# EAGLE schematic weather_sensor_attiny85 (EAGLE 8.4.2)
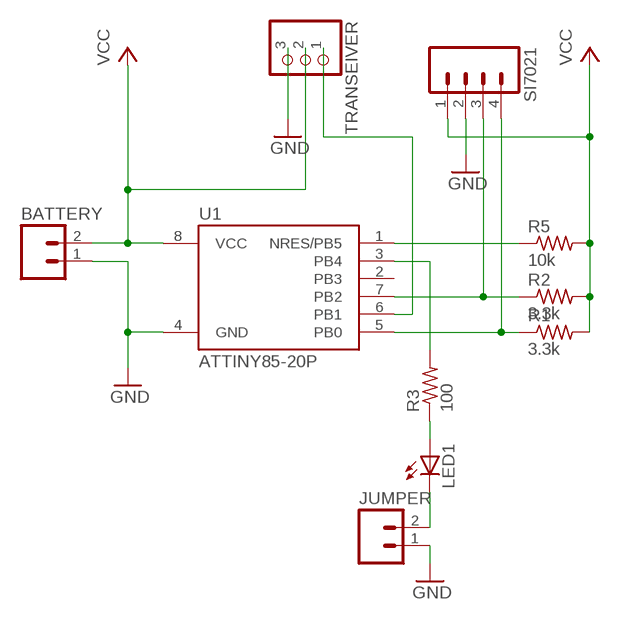
[diagram p0: schematic, sheet 1]

## Parts
BATTERY  M02LOCK  [1X02_LOCK]
JUMPER  M02LOCK  [1X02_LOCK]
LED1  LEDCHIPLED_0603  [CHIPLED_0603]
R1  3.3k  R-US_R0402  [R0402]
R2  3.3k  R-US_R0402  [R0402]
R3  100  R-US_R0402  [R0402]
R5  10k  R-US_R0402  [R0402]
SI7021  M04LONGPADS  [1X04_LONGPADS]
TRANSEIVER  PINHD-1X3  [1X03]
U1  ATTINY85-20P  [PDIP08_300MIL]

## Nets
GND: BATTERY.1 JUMPER.1 SI7021.2 TRANSEIVER.3 U1.4(GND)
N$1: JUMPER.2 LED1.C
N$2: TRANSEIVER.1 U1.6(PB1)
N$4: R1.1 SI7021.4 U1.5(PB0)
N$5: R2.1 SI7021.3 U1.7(PB2)
N$7: R3.2 U1.3(PB4)
N$8: R5.1 U1.1(NRES/PB5)
N$9: LED1.A R3.1
VCC: BATTERY.2 R1.2 R2.2 R5.2 SI7021.1 TRANSEIVER.2 U1.8(VCC)
Unconnected: U1.2(PB3)

## Library data of the parts
BATTERY JUMPER = SparkFun:M02: Header 2 Standard 2-pin 0.1" header. Use with straight break away headers (SKU : PRT-00116), right angle break away headers (PRT-00553), swiss pins (PRT-00743), machine pins (PRT-00117), and female headers (PRT-00115). Molex polarized connector foot print use with SKU : PRT-08233 with associated crimp pins and housings.
LED1 = adafruit:LED: LED OSRAM: - CHIPLED LG R971, LG N971, LY N971, LG Q971, LY Q971, LO R971, LY R971 LH N974, LH R974 LS Q976, LO Q976, LY Q976 LO Q996 - Hyper CHIPLED LW Q18S LB Q993, LB Q99A, LB R99A - SideLED LS A670, LO A670, LY A670, LG A670, LP A670 LB A673, LV A673, LT A673, LW A673 LH A674 LY A675 LS A676, LA A676, LO A676, LY A676, LW A676 LS A679, LY A679, LG A679 - Hyper Micro SIDELED® LS Y876, LA Y876, LO Y876, LY Y876 LT Y87S - SmartLED LW L88C, LW L88S LB L89C, LB L89S, LG L890 LS L89K, LO L89K, LY L89K LS L896, LA L896, LO L896, LY L896 - TOPLED LS T670, LO T670, LY T670, LG T670, LP T670 LSG T670, LSP T670, LSY T670, LOP T670, LYG T670 LG T671, LOG T671, LSG T671 LB T673, LV T673, LT T673, LW T673 LH T674 LS T676, LA T676, LO T676, LY T676, LB T676, LH T676, LSB T676, LW T676 LB T67C, LV T67C, LT T67C, LS T67K, LO T67K, LY T67K, LW E67C LS E67B, LA E67B, LO E67B, LY E67B, LB E67C, LV E67C, LT E67C LW T67C LS T679, LY T679, LG T679 LS T770, LO T770, LY T770, LG T770, LP T770 LB T773, LV T773, LT T773, LW T773 LH T774 LS E675, LA E675, LY E675, LS T675 LS T776, LA T776, LO T776, LY T776, LB T776 LHGB T686 LT T68C, LB T68C - Hyper Mini TOPLED® LB M676 - Mini TOPLED Santana® LG M470 LS M47K, LO M47K, LY M47K Source: http://www.osram.convergy.de/
R1-R3 R5 = adafruit:R-US_: RESISTOR, American symbol
SI7021 = SparkFun:M04: Header 4 Standard 4-pin 0.1" header. Use with straight break away headers (SKU : PRT-00116), right angle break away headers (PRT-00553), swiss pins (PRT-00743), machine pins (PRT-00117), and female headers (PRT-00115). Molex polarized connector foot print use with SKU : PRT-08231 with associated crimp pins and housings. 1MM SMD Version SKU: PRT-10208
TRANSEIVER = adafruit:PINHD-1X3: PIN HEADER
U1 = attiny25_45_85:ATTINY85*: ATMEL ATtiny 85 Packages: P = PDIP 08 30mil S = SOIC 08 EIAJ 208mil Technologies Note: for complete ordering code (temp. range, finish, tape&reel etc.) see www.atmel.com • Supply Voltage: V = (1.8…5.5)V | [blank] = (2.7…5.5)V • Speed: 10 = 10 MHz | 20 = 20 MHz Author: Dipl.-Ing. FH Rainer Bayer HHN Hochschule Heilbronn (Heilbronn University), rainer.bayer@hs-heilbronn.de Ingenieurbüro ing-rb, mail@ing-rb.de